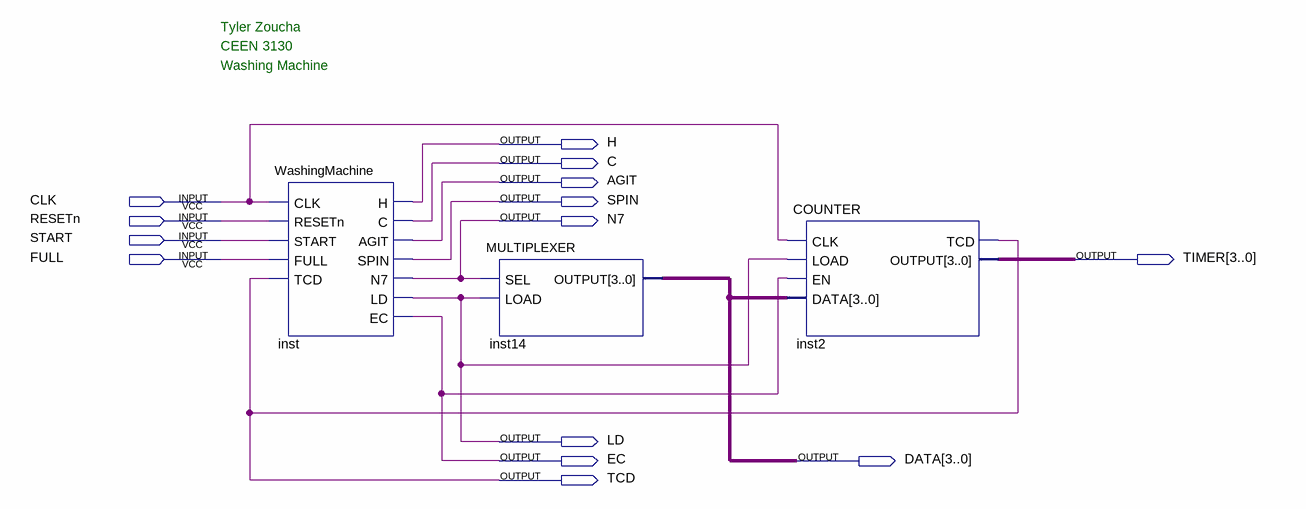
[diagram p0: schematic sheet]
// Quartus schematic WashingMachineSchematic.bdf as structural Verilog: 3 symbols, 14 pins
module WashingMachineSchematic (
  input  CLK,
  input  RESETn,
  input  START,
  input  FULL,
  output H,
  output C,
  output AGIT,
  output SPIN,
  output N7,
  output [3:0] TIMER,
  output LD,
  output EC,
  output [3:0] DATA,
  output TCD
);

  WashingMachine inst (
    .CLK(CLK), .RESETn(RESETn), .START(START), .FULL(FULL), .TCD(TCD), .H(H), .C(C), .AGIT(AGIT),
    .SPIN(SPIN), .N7(N7), .LD(LD), .EC(EC));
  MULTIPLEXER inst14 (.SEL(N7), .LOAD(LD), .OUTPUT(DATA));
  COUNTER inst2 (.CLK(CLK), .LOAD(LD), .EN(EC), .DATA(DATA), .TCD(TCD), .OUTPUT(TIMER));

  // Notes on the sheet:
  //   Tyler Zoucha
  //   CEEN 3130
  //   Washing Machine
endmodule
